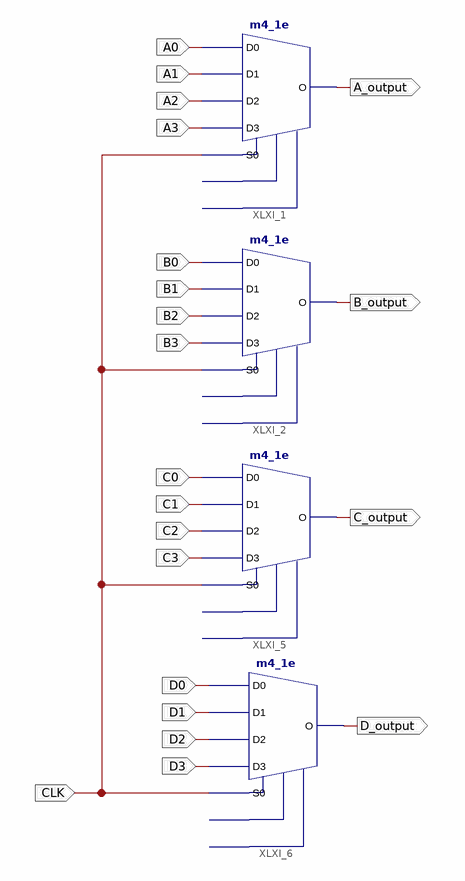
[diagram p0: schematic sheet 1]
// Xilinx ISE schematic MuxIN4_1_4_CLK.sch (spartan6) as structural Verilog: 4 symbols, 21 ports
module MuxIN4_1_4_CLK (
  input  A0,
  input  A1,
  input  A2,
  input  A3,
  input  B0,
  input  B1,
  input  B2,
  input  B3,
  input  C0,
  input  C1,
  input  C2,
  input  C3,
  input  D0,
  input  D1,
  input  D2,
  input  D3,
  input  CLK,
  output A_output,
  output B_output,
  output C_output,
  output D_output
);

  m4_1e XLXI_1 (.D0(A0), .D1(A1), .D2(A2), .D3(A3), .S0(CLK), .O(A_output));  // open: E, S1
  m4_1e XLXI_2 (.D0(B0), .D1(B1), .D2(B2), .D3(B3), .S0(CLK), .O(B_output));  // open: E, S1
  m4_1e XLXI_5 (.D0(C0), .D1(C1), .D2(C2), .D3(C3), .S0(CLK), .O(C_output));  // open: E, S1
  m4_1e XLXI_6 (.D0(D0), .D1(D1), .D2(D2), .D3(D3), .S0(CLK), .O(D_output));  // open: E, S1
endmodule
